# EAGLE design SIO2-dev (EAGLE 9.4.2)
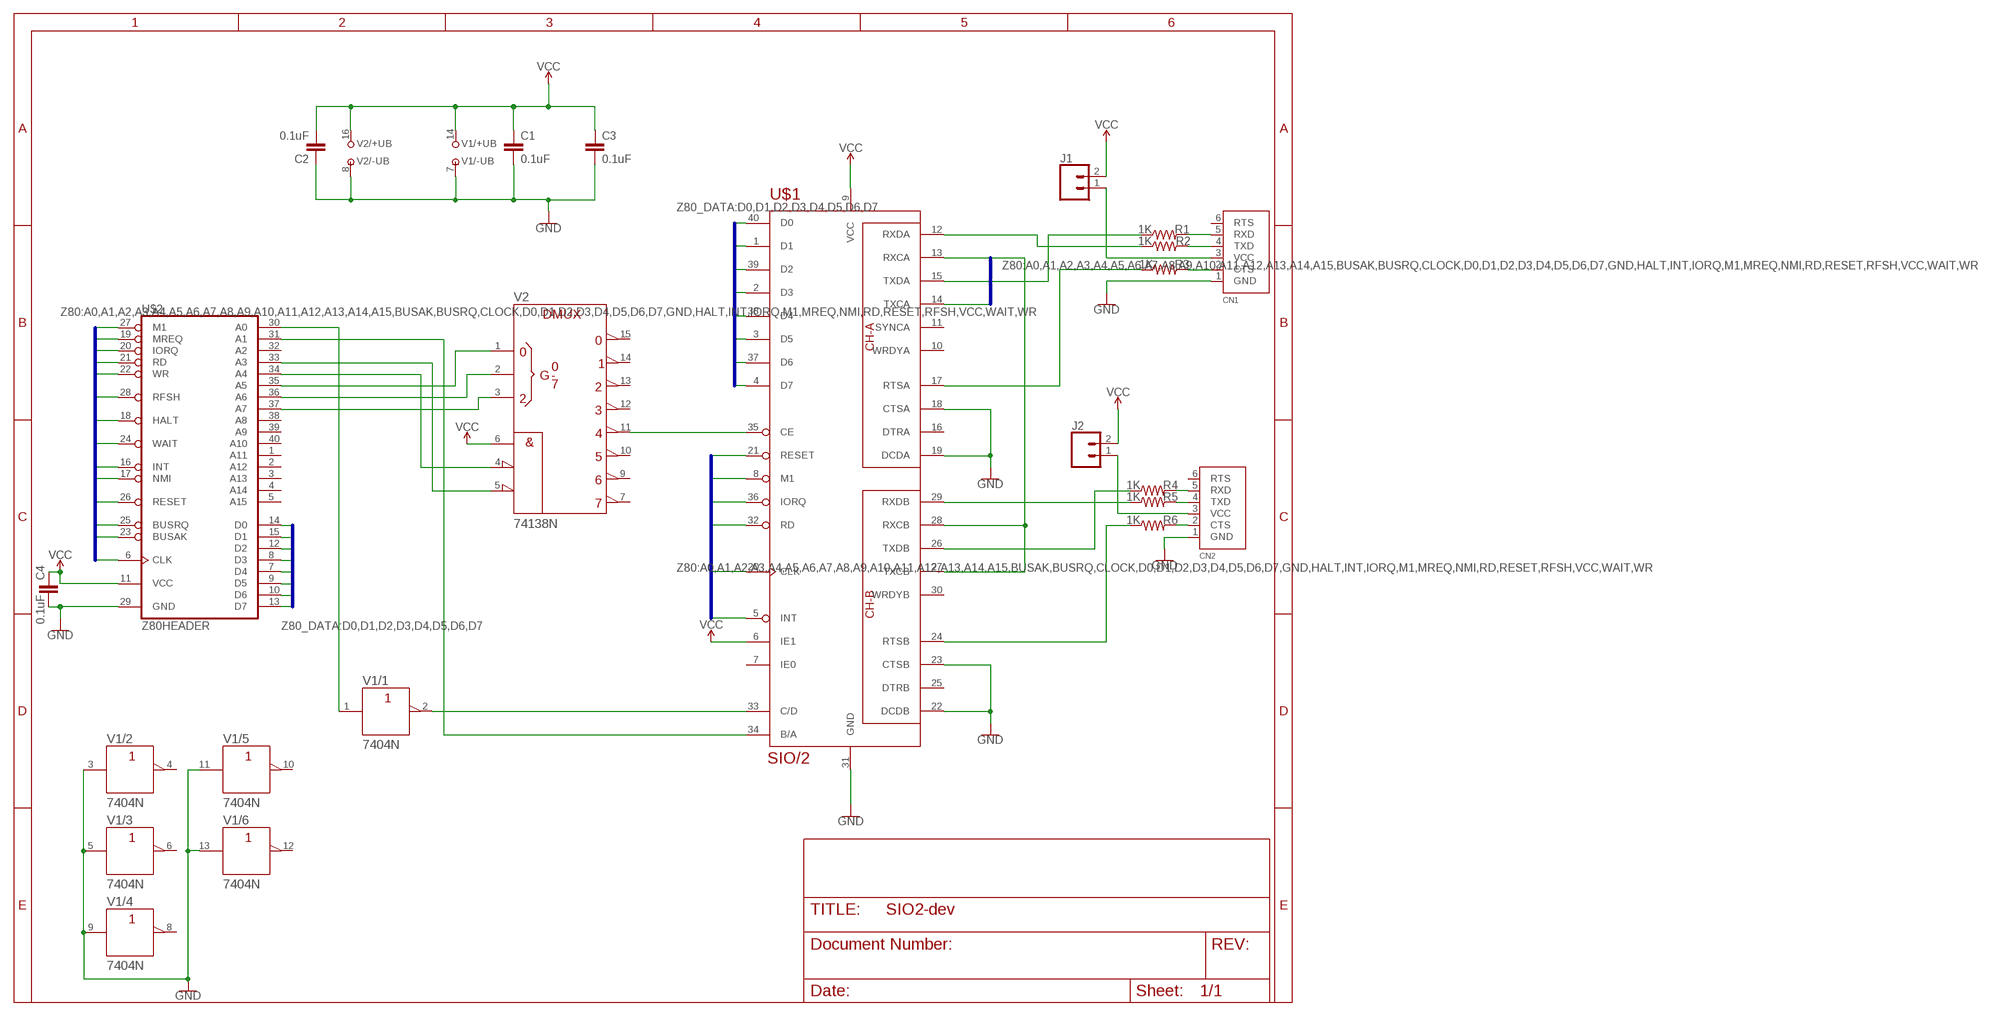
[diagram p0: schematic, sheet 1]

## Parts
C1  0.1uF  C2,5-3  [C2.5-3]
C2  0.1uF  C2,5-3  [C2.5-3]
C3  0.1uF  C2,5-3  [C2.5-3]
C4  0.1uF  C2,5-3  [C2.5-3]
CN1  FTDIUSBCABLE  [1X06_ROUND]
CN2  FTDIUSBCABLE  [1X06_ROUND]
J1  CONN_02  [1X02]
J2  CONN_02  [1X02]
R1  1K  RESISTORAXIAL-0.3  [AXIAL-0.3]
R2  1K  RESISTORAXIAL-0.3  [AXIAL-0.3]
R3  1K  RESISTORAXIAL-0.3  [AXIAL-0.3]
R4  1K  RESISTORAXIAL-0.3  [AXIAL-0.3]
R5  1K  RESISTORAXIAL-0.3  [AXIAL-0.3]
R6  1K  RESISTORAXIAL-0.3  [AXIAL-0.3]
U$1  SIO/2  [DIL40]
U$2  Z80HEADER  [2X20]
V1  7404N  [DIL14]
V2  74138N  [DIL16]

## Nets
BUSAK: U$2.23(BUSAK)
BUSRQ: U$2.25(BUSRQ)
CLOCK: U$1.13(RXCA) U$1.14(TXCA) U$1.20(CLK) U$1.27(TXCB) U$1.28(RXCB) U$2.6(CLK)
D0: U$1.40(D0) U$2.14(D0)
D1: U$1.1(D1) U$2.15(D1)
D2: U$1.39(D2) U$2.12(D2)
D3: U$1.2(D3) U$2.8(D3)
D4: U$1.38(D4) U$2.7(D4)
D5: U$1.3(D5) U$2.9(D5)
D6: U$1.37(D6) U$2.10(D6)
D7: U$1.4(D7) U$2.13(D7)
GND: C1.2 C2.1 C3.2 C4.2 CN1.1(GND) CN2.1(GND) U$1.18(CTSA) U$1.19(DCDA) U$1.22(DCDB) U$1.23(CTSB) U$1.31(GND) U$2.29(GND) V1.3(/2:A) V1.5(/3:A) V1.7(/-UB:-UB) V1.9(/4:A) V1.11(/5:A) V1.13(/6:A) V2.8(-UB)
HALT: U$2.18(HALT)
INT: U$1.5(INT) U$2.16(INT)
IORQ: U$1.36(IORQ) U$2.20(IORQ)
M1: U$1.8(M1) U$2.27(M1)
MREQ: U$2.19(MREQ)
N$1: U$1.34(B/A) U$2.31(A1)
N$2: U$1.35(CE) V2.11(Y4)
N$3: U$2.30(A0) V1.1(/1:A)
N$4: U$1.33(C/D) V1.2(/1:Y)
N$5: U$2.33(A3) V2.5(!G2B)
N$6: U$2.34(A4) V2.4(!G2A)
N$7: U$2.35(A5) V2.1(A)
N$8: U$2.36(A6) V2.2(B)
N$9: U$2.37(A7) V2.3(C)
N$10: R2.P$1 U$1.12(RXDA)
N$11: R1.P$1 U$1.15(TXDA)
N$12: R3.P$1 U$1.17(RTSA)
N$13: CN1.2(CTS) R3.P$2
N$14: CN1.4(TXD) R2.P$2
N$15: CN1.5(RXD) R1.P$2
N$16: R6.P$1 U$1.24(RTSB)
N$17: R5.P$1 U$1.29(RXDB)
N$18: CN2.4(TXD) R5.P$2
N$19: CN2.2(CTS) R6.P$2
N$20: CN2.5(RXD) R4.P$2
N$21: CN1.3(VCC) J1.1
N$22: CN2.3(VCC) J2.1
N$23: R4.P$1 U$1.26(TXDB)
NMI: U$2.17(NMI)
RD: U$1.32(RD) U$2.21(RD)
RESET: U$1.21(RESET) U$2.26(RESET)
RFSH: U$2.28(RFSH)
VCC: C1.1 C2.2 C3.1 C4.1 J1.2 J2.2 U$1.6(IE1) U$1.9(VCC) U$2.11(VCC) V1.14(/+UB:+UB) V2.6(G1) V2.16(+UB)
WAIT: U$2.24(WAIT)
WR: U$2.22(WR)
Unconnected: CN1.6(RTS) CN2.6(RTS) U$1.7(IE0) U$1.10(WRDYA) U$1.11(SYNCA) U$1.16(DTRA) U$1.25(DTRB) U$1.30(WRDYB) U$2.1(A11) U$2.2(A12) U$2.3(A13) U$2.4(A14) U$2.5(A15) U$2.32(A2) U$2.38(A8) U$2.39(A9) U$2.40(A10) V1.4(/2:Y) V1.6(/3:Y) V1.8(/4:Y) V1.10(/5:Y) V1.12(/6:Y) V2.7(Y7) V2.9(Y6) V2.10(Y5) V2.12(Y3) V2.13(Y2) V2.14(Y1) V2.15(Y0)

## Buses
Z80:A0,A1,A2,A3,A4,A5,A6,A7,A8,A9,A10,A11,A12,A13,A14,A15,BUSAK,BUSRQ,CLOCK,D0,D1,D2,D3,D4,D5,D6,D7,GND,HALT,INT,IORQ,M1,MREQ,NMI,RD,RESET,RFSH,VCC,WAIT,WR
Z80_DATA:D0,D1,D2,D3,D4,D5,D6,D7

## Library data of the parts
C1-C4 = capacitor-wima:C: CAPACITOR naming: grid - package width
CN1 CN2 = microbuilder:FTDIUSBCABLE: FTDI TTL-232R USB Cable Connector for FTDI's USB->RS232 Cable
J1 J2 = SparkFun-Connectors:CONN_02: Multi connection point. Often used as Generic Header-pin footprint for 0.1 inch spaced/style header connections On any of the 0.1 inch spaced packages, you can populate with these: Break Away Headers - Straight <https://www.sparkfun.com/products/116> (PRT-00116) Break Away Male Headers - Right Angle <https://www.sparkfun.com/products/553> (PRT-00553) Female Headers <https://www.sparkfun.com/products/115> (PRT-00115) Break Away Headers - Machine Pin <https://www.sparkfun.com/products/117> (PRT-00117) Break Away Female Headers - Swiss Machine Pin <https://www.sparkfun.com/products/743> (PRT-00743) For SCREWTERMINALS and SPRING TERMINALS visit here: Screw Terimnals on SparkFun.com <https://www.sparkfun.com/search/results?term=Screw+Terminals> (5mm/3.5mm/2.54mm spacing) This device is also useful as a general connection point to wire up your design to another part of your project. Our various solder wires solder well into these plated through hole pads. Hook-Up Wire - Assortment (Stranded, 22 AWG) <https://www.sparkfun.com/products/11375> (PRT-11375) Hook-Up Wire - Assortment (Solid Core, 22 AWG) <https://www.sparkfun.com/products/11367> (PRT-11367) View the entire wire category on our website here <https://www.sparkfun.com/categories/141> Special notes: Molex polarized connector foot print use with: PRT-08233 with associated crimp pins and housings. 2.54_SCREWTERM for use with PRT-10571. 3.5mm Screw Terminal footprints for PRT-08084 5mm Screw Terminal footprints for use with PRT-08432
R1-R6 = SparkFun-Resistors:RESISTOR: Generic Resistor Package
U$1 = wntrmute:SIO/2
U$2 = wntrmute:Z80
V1 = 74ttl-din:74*04: Hex INVERTER
V2 = 74ttl-din:74*138: 3-line to 8-line DECODER/DEMULTIPLEXER

## Net classes
0 default: width 0.152 mm, drill 0.254 mm, clearance 0.152 mm

## Board
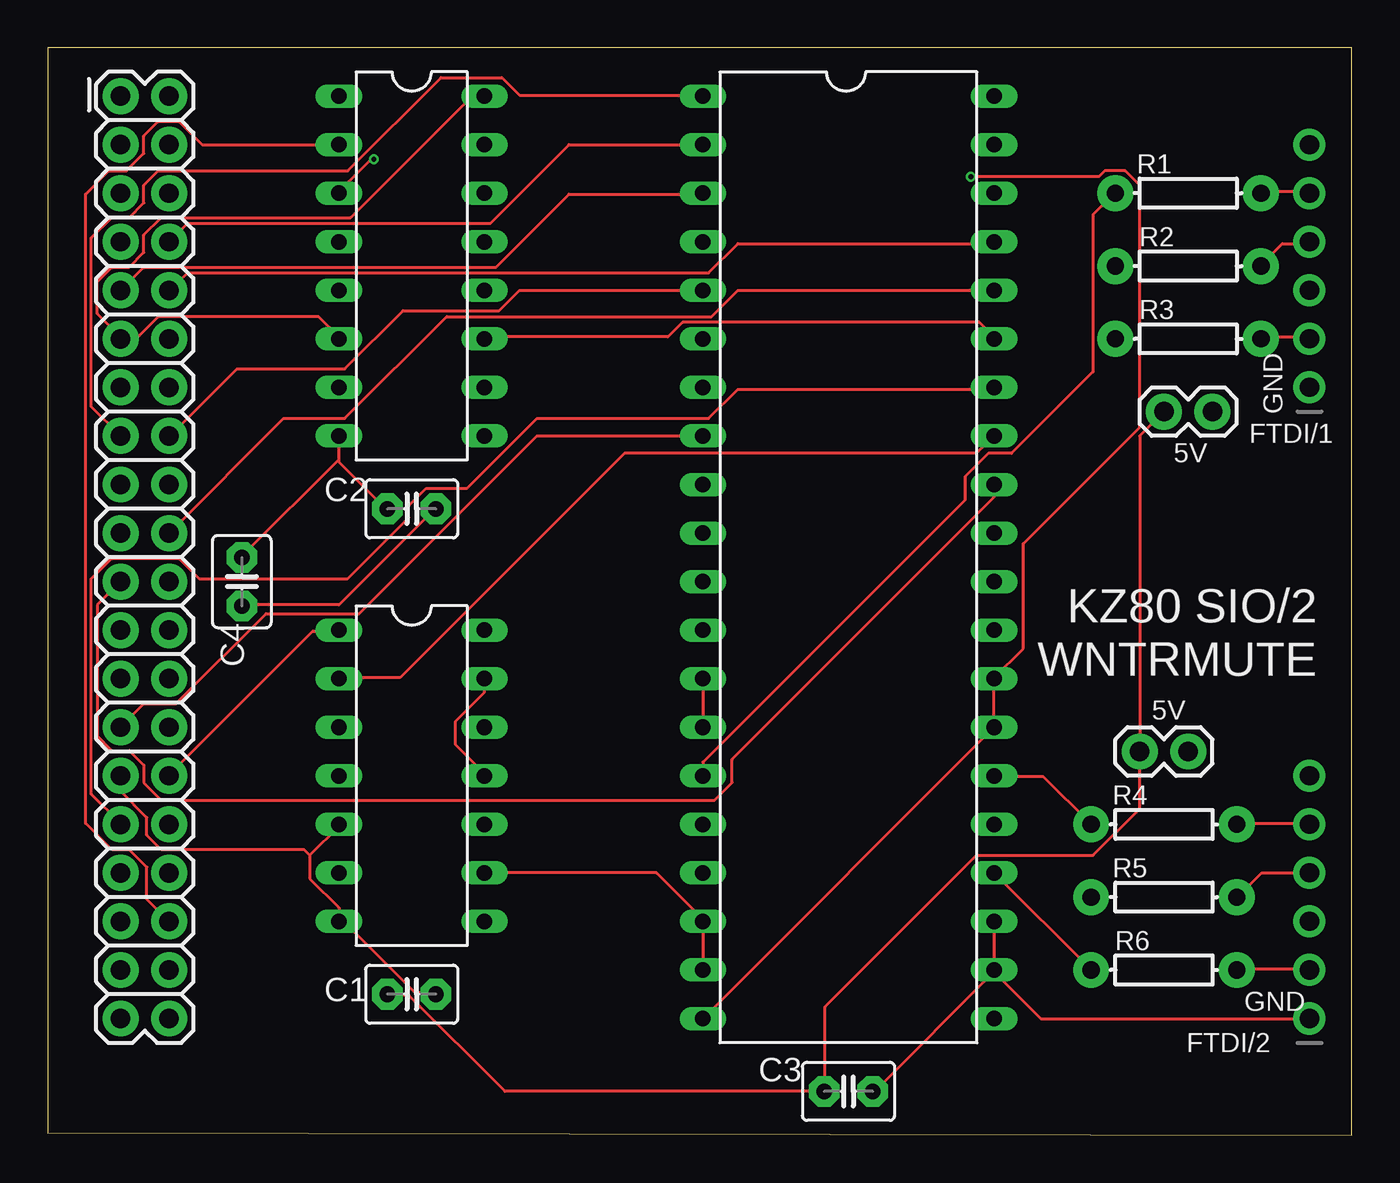
[diagram p1: board, top side]
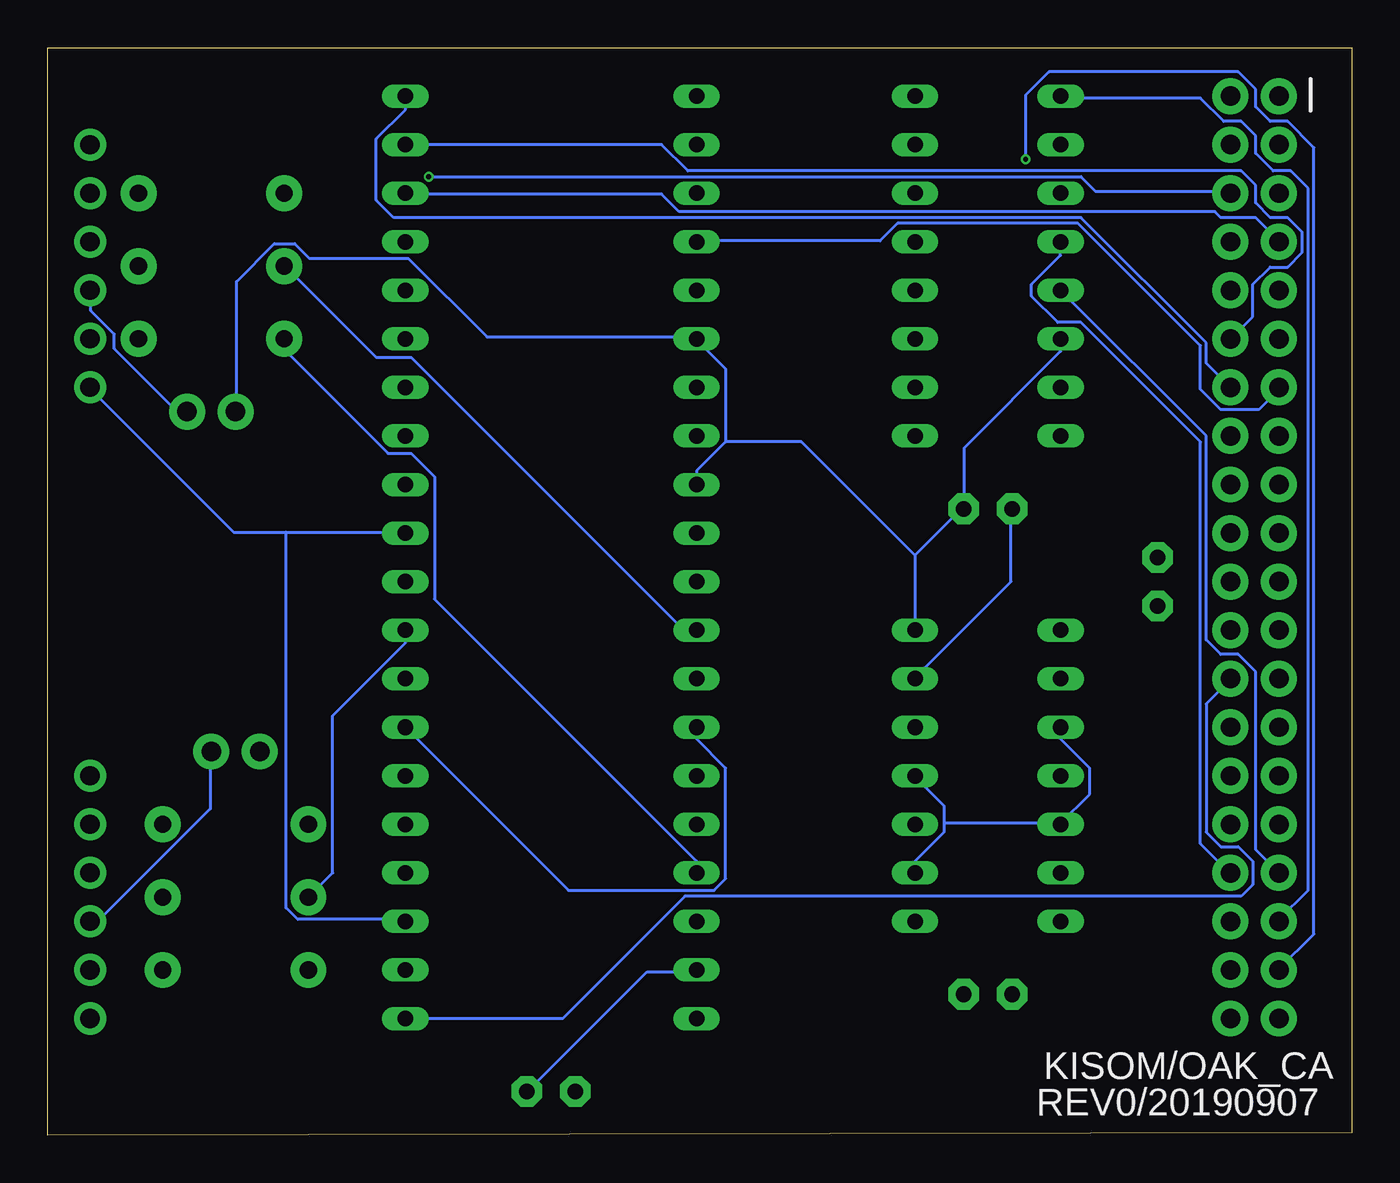
[diagram p2: board, bottom side, seen from below]

Size 68.25 x 56.89 mm. Coordinates in mm from the lower left corner, seen from the top.
Outline: 0,0.13 68.25,0 68.25,56.89 0,56.89 0,0.13
Copper layers (1*16): Top 0.035559375mm / dielectric 1.6mm / Bottom 0.035559375mm
Design rules "oshpark-2layer": minimum track width 6mil, minimum drill 10mil, track to track 6mil, track to pad 6mil, pad to pad 6mil, via to via 6mil, smd to smd 6mil, copper to edge 15mil, drill to drill 6mil, minimum pad ring 5mil, minimum via ring 5mil, stop-mask expansion 2.5mil, vias tented up to drill 0mil, thermal gap 10mil

### Footprints (pad centres in the part's own frame; a part is rotated, then mirrored left to right if it is on the bottom)
C2.5-3 = drill 0.813 pad 1.6 octagon: 1 -1.27,0; 2 1.27,0
1X06_ROUND = drill 1 pad 1.676: 1 -6.35,0; 2 -3.81,0; 3 -1.27,0; 4 1.27,0; 5 3.81,0; 6 6.35,0
1X02 = drill 1.016 pad 1.88: 1 0,0; 2 2.54,0
AXIAL-0.3 = drill 0.9 pad 1.88: P$1 -3.81,0; P$2 3.81,0
DIL40 = drill 0.813 long: 1 -24.13,-7.62; 2 -21.59,-7.62; 3 -19.05,-7.62; 4 -16.51,-7.62; 5 -13.97,-7.62; 6 -11.43,-7.62; 7 -8.89,-7.62; 8 -6.35,-7.62; 9 -3.81,-7.62; 10 -1.27,-7.62; 11 1.27,-7.62; 12 3.81,-7.62; 13 6.35,-7.62; 14 8.89,-7.62; 15 11.43,-7.62; 16 13.97,-7.62; 17 16.51,-7.62; 18 19.05,-7.62; 19 21.59,-7.62; 20 24.13,-7.62; 21 24.13,7.62; 22 21.59,7.62; 23 19.05,7.62; 24 16.51,7.62; 25 13.97,7.62; 26 11.43,7.62; 27 8.89,7.62; 28 6.35,7.62; 29 3.81,7.62; 30 1.27,7.62; 31 -1.27,7.62; 32 -3.81,7.62; 33 -6.35,7.62; 34 -8.89,7.62; 35 -11.43,7.62; 36 -13.97,7.62; 37 -16.51,7.62; 38 -19.05,7.62; 39 -21.59,7.62; 40 -24.13,7.62
2X20 = drill 1.016 pad 1.88: 1 0,0; 2 0,2.54; 3 2.54,0; 4 2.54,2.54; 5 5.08,0; 6 5.08,2.54; 7 7.62,0; 8 7.62,2.54; 9 10.16,0; 10 10.16,2.54; 11 12.7,0; 12 12.7,2.54; 13 15.24,0; 14 15.24,2.54; 15 17.78,0; 16 17.78,2.54; 17 20.32,0; 18 20.32,2.54; 19 22.86,0; 20 22.86,2.54; 21 25.4,0; 22 25.4,2.54; 23 27.94,0; 24 27.94,2.54; 25 30.48,0; 26 30.48,2.54; 27 33.02,0; 28 33.02,2.54; 29 35.56,0; 30 35.56,2.54; 31 38.1,0; 32 38.1,2.54; 33 40.64,0; 34 40.64,2.54; 35 43.18,0; 36 43.18,2.54; 37 45.72,0; 38 45.72,2.54; 39 48.26,0; 40 48.26,2.54
DIL14 = drill 0.813 long: 1 -7.62,-3.81; 2 -5.08,-3.81; 3 -2.54,-3.81; 4 0,-3.81; 5 2.54,-3.81; 6 5.08,-3.81; 7 7.62,-3.81; 8 7.62,3.81; 9 5.08,3.81; 10 2.54,3.81; 11 0,3.81; 12 -2.54,3.81; 13 -5.08,3.81; 14 -7.62,3.81
DIL16 = drill 0.813 long: 1 -8.89,-3.81; 2 -6.35,-3.81; 3 -3.81,-3.81; 4 -1.27,-3.81; 5 1.27,-3.81; 6 3.81,-3.81; 7 6.35,-3.81; 8 8.89,-3.81; 9 8.89,3.81; 10 6.35,3.81; 11 3.81,3.81; 12 1.27,3.81; 13 -1.27,3.81; 14 -3.81,3.81; 15 -6.35,3.81; 16 -8.89,3.81

### Placement (x,y rotation side)
C1  19.05,7.37 0 top
C2  19.05,32.77 0 top
C3  41.91,2.29 0 top
C4  10.16,28.96 90 top
CN1  66.04,45.47 90 top
CN2  66.04,12.45 90 top
J1  60.96,37.85 180 top
J2  59.69,20.07 180 top
R1  59.69,49.28 0 top
R2  59.69,45.47 0 top
R3  59.69,41.66 0 top
R4  58.42,16.26 0 top
R5  58.42,12.45 0 top
R6  58.42,8.64 0 top
U$1  41.91,30.23 270 top
U$2  3.81,54.36 270 top
V1  19.05,18.8 270 top
V2  19.05,45.47 270 top

### Tracks (layer width: path | path; a pad name or v marks a point on that pad's centre or on a via)
CLOCK  (via drill 0.25)
  Top 0.152: U$1.13 U$1.14 | U$1.20 U$1.27 U$1.28 49.53,23.93 51.05,25.45 51.05,30.94 57.15,37.03 57.15,49.68 56.39,50.44 55.32,50.44 55.02,50.14 v48.31,50.14
  Bottom 0.152: U$1.14 34.29,20.73 32.77,19.2 32.77,13.41 33.38,12.8 41,12.8 U$1.27 | v48.31,50.14 14.17,50.14 13.41,49.38 6.4,49.38 U$2.6
D0
  Bottom 0.152: U$1.40 49.53,53.64 51.05,52.12 51.05,48.92 50.14,48.01 14.17,48.01 7.62,41.45 7.62,40.39 U$2.14
D1
  Top 0.152: U$2.15 2.29,38.1 2.29,46.94 3.35,48.01 4.27,48.01 5.03,48.77 5.03,49.68 5.79,50.44 15.7,50.44 20.57,55.32 23.77,55.32 24.69,54.41 34.29,54.41 U$1.1
D2
  Bottom 0.152: U$1.39 36.12,51.82 34.75,50.44 5.79,50.44 5.03,49.68 5.03,48.77 4.27,48.01 3.35,48.01 2.59,47.24 2.59,46.18 3.35,45.41 4.27,45.41 5.18,44.5 5.18,42.82 U$2.12
D3
  Top 0.152: U$1.2 27.28,51.82 23.16,47.7 7.32,47.7 U$2.8
D4
  Bottom 0.152: U$1.38 49.53,49.23 36.12,49.23 35.2,48.31 7.16,48.31 6.86,48.01 5.03,48.01 3.81,46.79 U$2.7
D5
  Top 0.152: U$2.9 5.03,45.41 23.47,45.41 27.28,49.23 34.29,49.23 U$1.3
D6
  Top 0.152: U$1.37 49.53,46.63 36.12,46.63 34.59,45.11 7.32,45.11 6.4,44.2 U$2.10
D7
  Bottom 0.152: U$1.4 34.29,46.79 24.69,46.79 23.77,47.7 14.33,47.7 7.92,41.3 7.92,39.01 6.86,37.95 4.88,37.95 3.81,39.01 U$2.13
GND
  Top 0.152: 15.24,35.36 15.24,35.2 17.68,32.77 C2.1 | 15.24,35.36 V2.8 | 15.24,35.36 10.21,30.33 C4.2 | V1.13 22.86,23.16 21.34,21.64 21.34,20.42 22.86,18.9 V1.11 | 15.24,11.43 15.24,11.89 13.72,13.41 13.72,14.63 | 15.24,11.43 V1.7 15.24,11.28 | 13.72,14.63 15.24,16.15 V1.5 | 15.24,11.43 19.2,7.47 20.27,7.47 C1.2 | U$2.29 3.81,17.98 5.18,16.61 5.18,15.7 5.94,14.93 13.41,14.93 13.72,14.63 | U$1.19 U$1.18 34.29,11.28 31.85,13.72 V1.9 | U$1.23 U$1.22 49.53,8.53 | 49.53,8.53 43.28,2.29 C3.2 | CN2.1 51.97,6.1 49.53,8.53
  Bottom 0.152: V1.9 22.86,14.33 21.34,15.85 21.34,16.31 | 21.34,16.31 21.34,17.22 22.86,18.74 V1.11 | V1.3 15.24,20.73 13.72,19.2 13.72,17.83 15.24,16.31 | 15.24,16.31 21.34,16.31 | 15.24,16.31 V1.5 | C2.1 17.83,32.77 17.83,28.96 22.86,23.93 V1.13 | 55.78,31.55 58.52,31.55 65.99,39.01 CN1.1 | 55.78,31.55 49.53,31.55 U$1.31 | U$1.19 34.29,8.53 36.88,8.53 43.13,2.29 C3.2 | 55.78,31.55 55.78,11.89 55.17,11.28 49.53,11.28 U$1.23
INT
  Top 0.152: U$1.5 24.69,44.2 23.62,43.13 18.59,43.13 15.54,40.08 9.91,40.08 6.4,36.58 U$2.16
IORQ
  Top 0.152: U$1.36 36.12,44.2 34.75,42.82 20.88,42.82 15.54,37.49 12.34,37.49 U$2.20
M1
  Top 0.152: U$1.8 25.6,36.58 16.31,27.28 11.43,27.28 6.71,22.55 5.03,22.55 U$2.27
N$1
  Top 0.152: U$1.34 49.53,39.01 36.12,39.01 34.59,37.49 25.6,37.49 21.95,33.83 19.81,33.83 18.9,32.92 18.9,32.31 15.7,29.11 7.92,29.11 6.86,30.18 3.35,30.18 2.29,29.11 2.29,17.83 3.81,16.31 U$2.31
N$2
  Top 0.152: V2.11 22.86,41.76 32.46,41.76 33.22,42.52 48.77,42.52 49.53,41.76 U$1.35
N$3
  Top 0.152: V1.1 15.24,26.36 13.87,26.36 6.4,18.9 U$2.30
N$4
  Top 0.152: U$1.33 48.62,35.66 30.18,35.66 18.44,23.93 15.24,23.93 V1.2
N$5
  Bottom 0.152: V2.5 7.62,36.58 7.62,25.91 6.86,25.15 5.94,25.15 5.03,24.23 5.03,14.93 U$2.33
N$6
  Bottom 0.152: V2.4 15.24,46.02 16.76,44.5 16.76,43.89 15.39,42.52 14.17,42.52 7.92,36.27 7.92,15.24 6.4,13.72 U$2.34
N$7
  Bottom 0.152: V2.1 15.24,54.25 7.92,54.25 6.71,53.03 5.79,53.03 5.03,52.27 5.03,51.36 4.12,50.44 3.2,50.44 2.29,49.53 2.29,12.8 3.81,11.28 U$2.35
N$8
  Top 0.152: V2.2 8.08,51.82 6.86,53.03 5.79,53.03 5.03,52.27 5.03,51.36 4.12,50.44 3.2,50.44 1.98,49.23 1.98,16.31 3.35,14.93 4.27,14.93 5.18,14.02 5.18,12.34 U$2.36
N$9  (via drill 0.25)
  Top 0.152: v17.07,51.05 16.92,51.05 15.24,49.38 V2.3
  Bottom 0.152: v17.07,51.05 17.07,54.41 15.85,55.63 5.94,55.63 5.03,54.71 5.03,53.8 4.27,53.03 3.35,53.03 1.98,51.66 1.98,10.52 3.81,8.69 U$2.37
N$10
  Bottom 0.152: U$1.12 34.29,26.52 35.05,26.52 49.23,40.69 51.05,40.69 55.78,45.41 R2.P$1
N$11
  Top 0.152: U$1.15 34.29,19.51 48.01,33.22 48.01,34.44 49.23,35.66 50.44,35.66 54.71,39.93 54.71,48.16 55.78,49.23 R1.P$1
N$12
  Bottom 0.152: U$1.17 34.29,14.33 48.01,28.04 48.01,34.44 49.23,35.66 50.44,35.66 55.78,41 55.78,41.6 R3.P$1
N$13
  Top 0.152: CN1.2 65.99,41.76 63.55,41.76 R3.P$2
N$14
  Top 0.152: CN1.4 65.99,46.63 64.62,46.63 63.55,45.57 R2.P$2
N$15
  Top 0.152: CN1.5 65.99,49.38 63.55,49.38 R1.P$2
N$16
  Top 0.152: R6.P$1 U$1.24
N$17
  Bottom 0.152: U$1.29 49.53,25.76 53.34,21.95 53.34,13.72 R5.P$1
N$18
  Top 0.152: CN2.4 63.55,13.72 62.33,12.5 R5.P$2
N$19
  Top 0.152: CN2.2 65.99,8.69 62.33,8.69 R6.P$2
N$20
  Top 0.152: CN2.5 65.99,16.31 62.33,16.31 R4.P$2
N$21
  Bottom 0.152: CN1.3 65.99,44.2 65.99,43.13 64.77,41.91 64.77,41.15 61.57,37.95 60.96,37.95 J1.1
N$22
  Bottom 0.152: CN2.3 65.99,11.28 65.53,11.28 59.74,17.07 59.74,19.96 J2.1
N$23
  Top 0.152: R4.P$1 52.12,18.74 49.53,18.74 U$1.26
RD
  Top 0.152: U$1.32 49.53,33.38 35.81,19.66 35.81,18.44 34.9,17.53 5.94,17.53 5.03,18.44 5.03,19.36 4.27,20.12 3.35,20.12 2.59,20.88 2.59,27.74 U$2.21
RESET
  Bottom 0.152: U$1.21 41.3,6.1 34.9,12.5 5.79,12.5 5.18,13.11 5.18,14.33 5.94,15.09 6.86,15.09 7.62,15.85 7.62,22.55 6.4,23.77 U$2.26
VCC
  Top 0.152: 3.81,41.76 2.59,42.98 2.59,44.65 3.35,45.41 4.27,45.41 5.03,46.18 5.03,47.09 5.94,48.01 15.85,48.01 22.1,54.25 22.86,54.25 V2.16 | C4.1 10.21,27.74 15.24,27.74 20.27,32.77 C2.2 | 3.81,41.76 4.72,41.76 5.79,42.82 14.17,42.82 15.24,41.76 V2.6 | 3.81,41.76 U$2.11 | J1.2 57.15,36.58 J2.2 57.15,17.07 54.71,14.63 48.62,14.63 40.69,6.71 40.69,2.29 C3.1 23.93,2.29 18.9,7.32 17.83,7.32 C1.1
  Bottom 0.152: U$1.9 34.29,34.75 32.77,36.27 | 32.77,36.27 32.77,40.08 34.29,41.6 U$1.6 34.29,41.76 45.26,41.76 49.38,45.87 54.56,45.87 55.32,46.63 56.39,46.63 58.37,44.65 58.37,37.95 J1.2 | 22.86,30.33 V1.14 | 22.86,30.33 20.42,32.77 C2.2 20.27,32.77 20.27,35.97 15.24,41 V2.6 | 32.77,36.27 28.8,36.27 22.86,30.33

### Text on the board
tPlace: GND | FTDI/1 | 5V | KZ80 SIO/2 | WNTRMUTE | 5V | GND | FTDI/2
bPlace: KISOM/OAK_CA | REV0/20190907